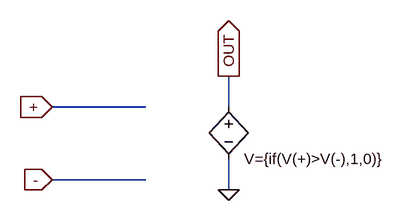
[diagram p0: schematic COM_Comparator.asc]
COM_Comparator.asc, the LTspice schematic file:
Version 4
SHEET 1 4896 2624
WIRE 2832 -384 2688 -384
WIRE 2960 -384 2960 -432
WIRE 2832 -272 2688 -272
WIRE 2960 -256 2960 -304
FLAG 2960 -256 0
FLAG 2688 -384 +
IOPIN 2688 -384 In
FLAG 2688 -272 -
IOPIN 2688 -272 In
FLAG 2960 -432 OUT
IOPIN 2960 -432 Out
SYMBOL bv 2960 -400 R0
WINDOW 0 24 16 Invisible 2
SYMATTR InstName 1
SYMATTR Value V={if(V(+)>V(-),1,0)}

The netlist it stands for:
* COM_Comparator.asc
B§1 OUT 0 V={if(V(+)>V(-),1,0)}
.backanno
.end